# EAGLE design lime-lemon (EAGLE 7.4.0)
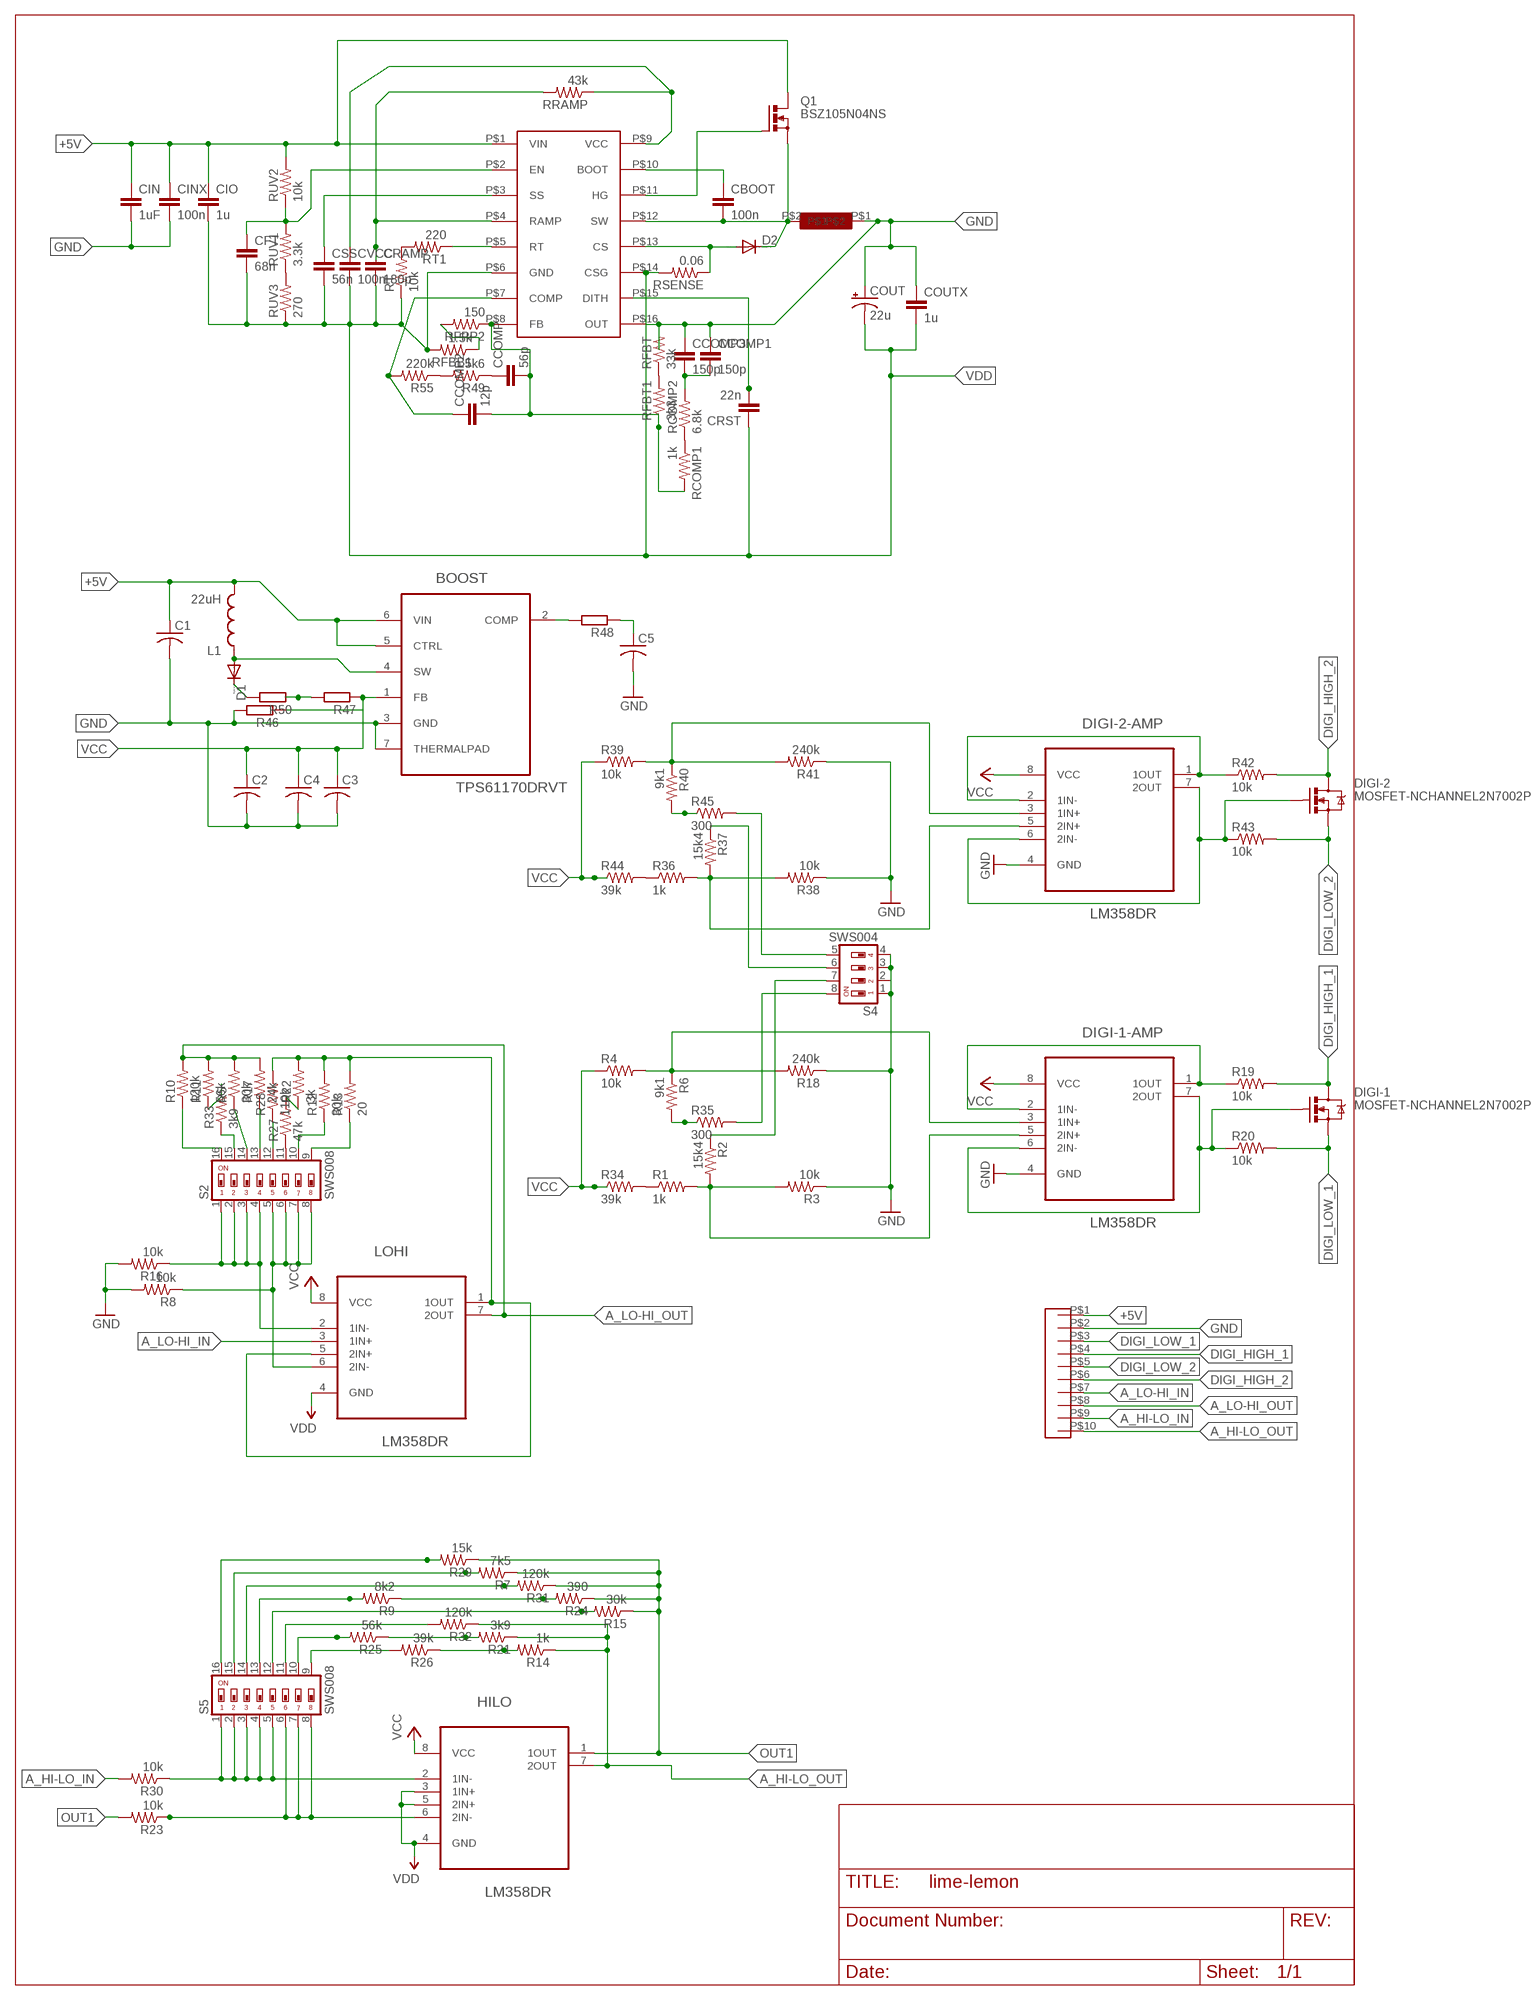
[diagram p0: schematic, sheet 1]

## Parts
BOOST  TPS61170DRVT  [SON65P210X210X80-7N]
C1  C-USC1206  [C1206]
C2  C-USC0805  [C0805]
C3  C-USC1206  [C1206]
C4  C-USC1206  [C1206]
C5  C-USC1206  [C1206]
CBOOT  100n  C-EUC0805  [C0805]
CCOMP  56p  C-EUC0805  [C0805]
CCOMP1  150p  C-EUC0805  [C0805]
CCOMP2  12p  C-EUC0805  [C0805]
CCOMP3  150p  C-EUC0805  [C0805]
CFT  68n  C-EUC0805  [C0805]
CIN  1uF  C-EUC0805  [C0805]
CINX  100n  C-EUC0805  [C0805]
CIO  1u  C-EUC0805  [C0805]
COUT  22u  CPOL-USE5-5  [E5-5]
COUTX  1u  C-EUC0805  [C0805]
CRAMP  180p  C-EUC0805  [C0805]
CRST  22n  C-EUC0805  [C0805]
CSS  56n  C-EUC0805  [C0805]
CVCC  100n  C-EUC0805  [C0805]
D1  DIODE-SOD123  [SOD123]
D2  DIODE-SOD123  [SOD123]
DIGI-1  MOSFET-NCHANNEL2N7002PW  [SOT323]
DIGI-1-AMP  LM358DR  [SOIC127P600X175-8N]
DIGI-2  MOSFET-NCHANNEL2N7002PW  [SOT323]
DIGI-2-AMP  LM358DR  [SOIC127P600X175-8N]
HILO  LM358DR  [SOIC127P600X175-8N]
L1  22uH  INDUCTORBOURNS_SRN6045  [SRN6045]
LOHI  LM358DR  [SOIC127P600X175-8N]
Q1  BSZ105N04NS  [PG-TDSON-8]
R1  1k  R-US_R0805  [R0805]
R2  15k4  R-US_R0805  [R0805]
R3  10k  R-US_R0805  [R0805]
R4  10k  R-US_R0805  [R0805]
R5  30k  R-US_R0805  [R0805]
R6  9k1  R-US_R0805  [R0805]
R7  7k5  R-US_R0805  [R0805]
R8  10k  R-US_R0805  [R0805]
R9  8k2  R-US_R0805  [R0805]
R10  120k  R-US_R0805  [R0805]
R11  56k  R-US_R0805  [R0805]
R12  30k  R-US_R0805  [R0805]
R13  20  R-US_R0805  [R0805]
R14  1k  R-US_R0805  [R0805]
R15  30k  R-US_R0805  [R0805]
R16  10k  R-US_R0805  [R0805]
R17  24k  R-US_R0805  [R0805]
R18  240k  R-US_R0805  [R0805]
R19  10k  R-US_R0805  [R0805]
R20  10k  R-US_R0805  [R0805]
R21  3k9  R-US_R0805  [R0805]
R22  3k  R-US_R0805  [R0805]
R23  10k  R-US_R0805  [R0805]
R24  390  R-US_R0805  [R0805]
R25  56k  R-US_R0805  [R0805]
R26  39k  R-US_R0805  [R0805]
R27  47k  R-US_R0805  [R0805]
R28  110k  R-US_R0805  [R0805]
R29  15k  R-US_R0805  [R0805]
R30  10k  R-US_R0805  [R0805]
R31  120k  R-US_R0805  [R0805]
R32  120k  R-US_R0805  [R0805]
R33  3k9  R-US_R0805  [R0805]
R34  39k  R-US_R0805  [R0805]
R35  300  R-US_R0805  [R0805]
R36  1k  R-US_R0805  [R0805]
R37  15k4  R-US_R0805  [R0805]
R38  10k  R-US_R0805  [R0805]
R39  10k  R-US_R0805  [R0805]
R40  9k1  R-US_R0805  [R0805]
R41  240k  R-US_R0805  [R0805]
R42  10k  R-US_R0805  [R0805]
R43  10k  R-US_R0805  [R0805]
R44  39k  R-US_R0805  [R0805]
R45  300  R-US_R0805  [R0805]
R46  R-EU_R0805  [R0805]
R47  R-EU_R0805  [R0805]
R48  R-EU_R0805  [R0805]
R49  5k6  R-US_R0805  [R0805]
R50  R-EU_R0805  [R0805]
R55  220k  R-US_R0805  [R0805]
RCOMP1  1k  R-US_R0805  [R0805]
RCOMP2  6.8k  R-US_R0805  [R0805]
RFBB1  1.5k  R-US_R0805  [R0805]
RFBT  33k  R-US_R0805  [R0805]
RFBT1  3k3  R-US_R0805  [R0805]
RFPP2  150  R-US_R0805  [R0805]
RRAMP  43k  R-US_R0805  [R0805]
RSENSE  0.06  R-US_R0805  [R0805]
RT  10k  R-US_R0805  [R0805]
RT1  220  R-US_R0805  [R0805]
RUV1  3.3k  R-US_R0805  [R0805]
RUV2  10k  R-US_R0805  [R0805]
RUV3  270  R-US_R0805  [R0805]
S2  SWS008  [SMS-008]
S4  SWS004  [SMS-004]
S5  SWS008  [SMS-008]
U$1  5.08PITCHTERMINAL  [10KPL508]
U$2  LM5088  [LM5088]
U$3  KLICK_INDUCTOR01  [KLICK_INDUCTOR01]

## Nets
+5V: BOOST.5(CTRL) BOOST.6(VIN) C1.1 CIN.1 CINX.1 CIO.1 L1.2 Q1.5(D) Q1.6(D) Q1.7(D) Q1.8(D) Q1.TH(D) RUV2.2 U$1.P$1 U$2.P$1(VIN)
A_HI-LO_IN: R30.2 U$1.P$9
A_HI-LO_OUT: HILO.7(2OUT) R14.1 R21.1 R32.1 U$1.P$10
A_LO-HI_IN: LOHI.3(1IN+) U$1.P$7
A_LO-HI_OUT: LOHI.7(2OUT) R5.2 R10.2 R11.2 R17.2 U$1.P$8
DI-1: DIGI-1-AMP.1(1OUT) DIGI-1-AMP.2(1IN-) R19.1
DIGI_HIGH_1: DIGI-1.3(D) R19.2 U$1.P$4
DIGI_HIGH_2: DIGI-2.3(D) R42.2 U$1.P$6
DIGI_LOW_1: DIGI-1.2(S) R20.2 U$1.P$3
DIGI_LOW_2: DIGI-2.2(S) R43.2 U$1.P$5
GND: BOOST.3(GND) BOOST.7(THERMALPAD) C1.2 C2.2 C3.2 C4.2 C5.2 CCOMP1.1 CCOMP3.1 CIN.2 CINX.2 COUT.+ COUTX.1 DIGI-1-AMP.4(GND) DIGI-2-AMP.4(GND) R3.1 R8.2 R16.2 R18.1 R38.1 R41.1 R46.2 RFBT.2 S4.1 S4.2 S4.3 S4.4 U$1.P$2 U$2.P$16(OUT) U$3.P$1
N$2: DIGI-1-AMP.3(1IN+) R4.2 R6.1 R18.2
N$4: R2.1 S4.7
N$5: R6.2 R35.1
N$6: DIGI-1-AMP.5(2IN+) R1.2 R2.2 R3.2
N$8: DIGI-1-AMP.6(2IN-) DIGI-1-AMP.7(2OUT) DIGI-1.1(G) R20.1
N$9: DIGI-2-AMP.5(2IN+) R36.2 R37.2 R38.2
N$10: HILO.2(1IN-) R30.1 S5.1 S5.2 S5.3 S5.4 S5.5
N$11: DIGI-2-AMP.3(1IN+) R39.2 R40.1 R41.2
N$13: R10.1 S2.16
N$14: R33.1 S2.15
N$15: R1.1 R34.2
N$16: R5.1 S2.14
N$17: R17.1 S2.13
N$18: R28.1 S2.12
N$19: R27.1 S2.11
N$20: R12.1 S2.10
N$21: R13.1 S2.9
N$22: R29.2 S5.16
N$23: LOHI.1(1OUT) LOHI.5(2IN+) R12.2 R13.2 R22.2 R28.2
N$24: R7.2 S5.15
N$26: R31.2 S5.14
N$27: R9.2 S5.13
N$28: R15.2 S5.12
N$29: R32.2 S5.11
N$30: HILO.6(2IN-) R23.1 S5.6 S5.7 S5.8
N$31: R25.2 S5.10
N$32: R26.2 S5.9
N$34: R14.2 R26.1
N$36: R21.2 R25.1
N$37: R9.1 R24.2
N$38: R22.1 R27.2
N$41: R11.1 R33.2
N$42: R35.2 S4.8
N$43: CFT.1 RUV1.2 RUV2.1 U$2.P$2(EN)
N$44: BOOST.4(SW) D1.A L1.1
N$45: CSS.1 U$2.P$3(SS)
N$46: LOHI.2(1IN-) R16.1 S2.1 S2.2 S2.3 S2.4
N$47: R47.2 R50.1
N$48: CVCC.1 RRAMP.1 U$2.P$9(VCC)
N$49: BOOST.2(COMP) R48.2
N$50: LOHI.6(2IN-) R8.1 S2.5 S2.6 S2.7 S2.8
N$51: C5.1 R48.1
N$52: D2.A RSENSE.1 U$2.P$13(CS)
N$53: CRAMP.1 RRAMP.2 U$2.P$4(RAMP)
N$54: RT1.2 RT.2
N$55: RUV1.1 RUV3.2
N$56: CCOMP.1 R49.1
N$57: CCOMP2.2 CCOMP.2 RCOMP1.2 RFBT1.1 RFPP2.1 U$2.P$8(FB)
N$58: CCOMP2.1 R55.2 U$2.P$7(COMP)
N$59: CBOOT.1 U$2.P$10(BOOT)
N$60: CRST.2 U$2.P$15(DITH)
N$61: CBOOT.2 D2.C Q1.1(S) Q1.2(S) Q1.3(S) U$2.P$12(SW) U$3.P$2
N$62: RFBB1.1 RFPP2.2
N$63: DIGI-2-AMP.1(1OUT) DIGI-2-AMP.2(1IN-) R42.1
N$64: DIGI-2-AMP.6(2IN-) DIGI-2-AMP.7(2OUT) DIGI-2.1(G) R43.1
N$65: Q1.4(G) U$2.P$11(HG)
N$66: R49.2 R55.1
N$67: R37.1 S4.6
N$68: R36.1 R44.2
N$69: R40.2 R45.1
N$70: R45.2 S4.5
N$71: CCOMP1.2 CCOMP3.2 RCOMP2.2
N$72: RT1.1 U$2.P$5(RT)
N$73: RCOMP1.1 RCOMP2.1
N$74: RFBT1.2 RFBT.1
N$75: D1.C R50.2
OUT1: HILO.1(1OUT) R7.1 R15.1 R23.2 R24.1 R29.1 R31.1
VCC: BOOST.1(FB) C2.1 C3.1 C4.1 DIGI-1-AMP.8(VCC) DIGI-2-AMP.8(VCC) HILO.8(VCC) LOHI.8(VCC) R4.1 R34.1 R39.1 R44.1 R46.1 R47.1
VDD: CFT.2 CIO.2 COUT.- COUTX.2 CRAMP.2 CRST.1 CSS.2 CVCC.2 HILO.3(1IN+) HILO.4(GND) HILO.5(2IN+) LOHI.4(GND) RFBB1.2 RSENSE.2 RT.1 RUV3.1 U$2.P$6(GND) U$2.P$14(CSG)

## Library data of the parts
BOOST = Texas Instruments_By_element14_Batch_1:TPS61170DRVT: 1.2A High Voltage Boost Converter in 2x2mm2 QFN Package; MPN: TPS61170DRVT; OC_FARNELL: 1703404; OC_NEWARK: 65M6342; PACKAGE: SON-6; SUPPLIER: Texas Instruments
C1-C5 = rcl:C-US: CAPACITOR, American symbol
CBOOT CCOMP CCOMP1-CCOMP3 CFT CIN CINX CIO COUTX CRAMP CRST CSS CVCC = rcl:C-EU: CAPACITOR, European symbol
COUT = rcl:CPOL-US: POLARIZED CAPACITOR, American symbol
D1 D2 = diode:DIODE-: DIODE
DIGI-1 DIGI-2 = SparkFun-DiscreteSemi:MOSFET-NCHANNEL: Common NMOSFET Parts MFG P/N Store ID Prod ID FDD8780 TRANS-09984 SI7820DN TRANS-11055 FDS6630A IC-08089 2N7002PW TRANS-11151 FQP30N06L COM-10213 TRANS-10060 BSS123LT1G TRANS-08345 BSS138 TRANS-00830 BS170 2N7000; PROD_ID: TRANS-11151
DIGI-1-AMP DIGI-2-AMP HILO LOHI = Texas Instruments_By_element14_Batch_1:LM358DR: OPERATIONAL AMPLIFIERS; MPN: LM358DR; OC_FARNELL: 1831865; OC_NEWARK: 34K7599; PACKAGE: SOIC-8; SUPPLIER: Texas Instruments
L1 = SparkFun-Passives:INDUCTOR: Inductors Basic Inductor/Choke - 0603 and 1206. Footprints are not proven and vary greatly between part numbers. INDUCTOR POWER 3.3UH 4.0A SMD 0.197" L x 0.197" W x 0.177" H (5.00mm x 5.00mm x 4.50mm); PROD_ID: NDUC-11627; VALUE: 33uH
Q1 = transistor-power:BSZ105N04NS: OptiMOS (TM)3 Power-Transistor N-Channel, Normal level Source : Data sheet <http://www.infineon.com/dgdl/BSZ105N04NSG_rev1.1.pdf?folderId=db3a3043156fd5730115c7d50620107c&fileId=db3a30431689f4420116c485c67f084e>
R1-R45 R49 R55 RCOMP1 RCOMP2 RFBB1 RFBT RFBT1 RFPP2 RRAMP RSENSE RT RT1 RUV1-RUV3 = rcl:R-US_: RESISTOR, American symbol
R46-R48 R50 = rcl:R-EU_: RESISTOR, European symbol
S2 S5 = smd-special:SWS008: SMD Dip Switch 8 pol.
S4 = smd-special:SWS004: SMD Dip Switch 4 pol.
U$1 = ruuviliitin:5.08PITCHTERMINAL
U$2 = Klick_custom_lm5088:LM5088
U$3 = Klick_inductor01:KLICK_INDUCTOR01

## Board
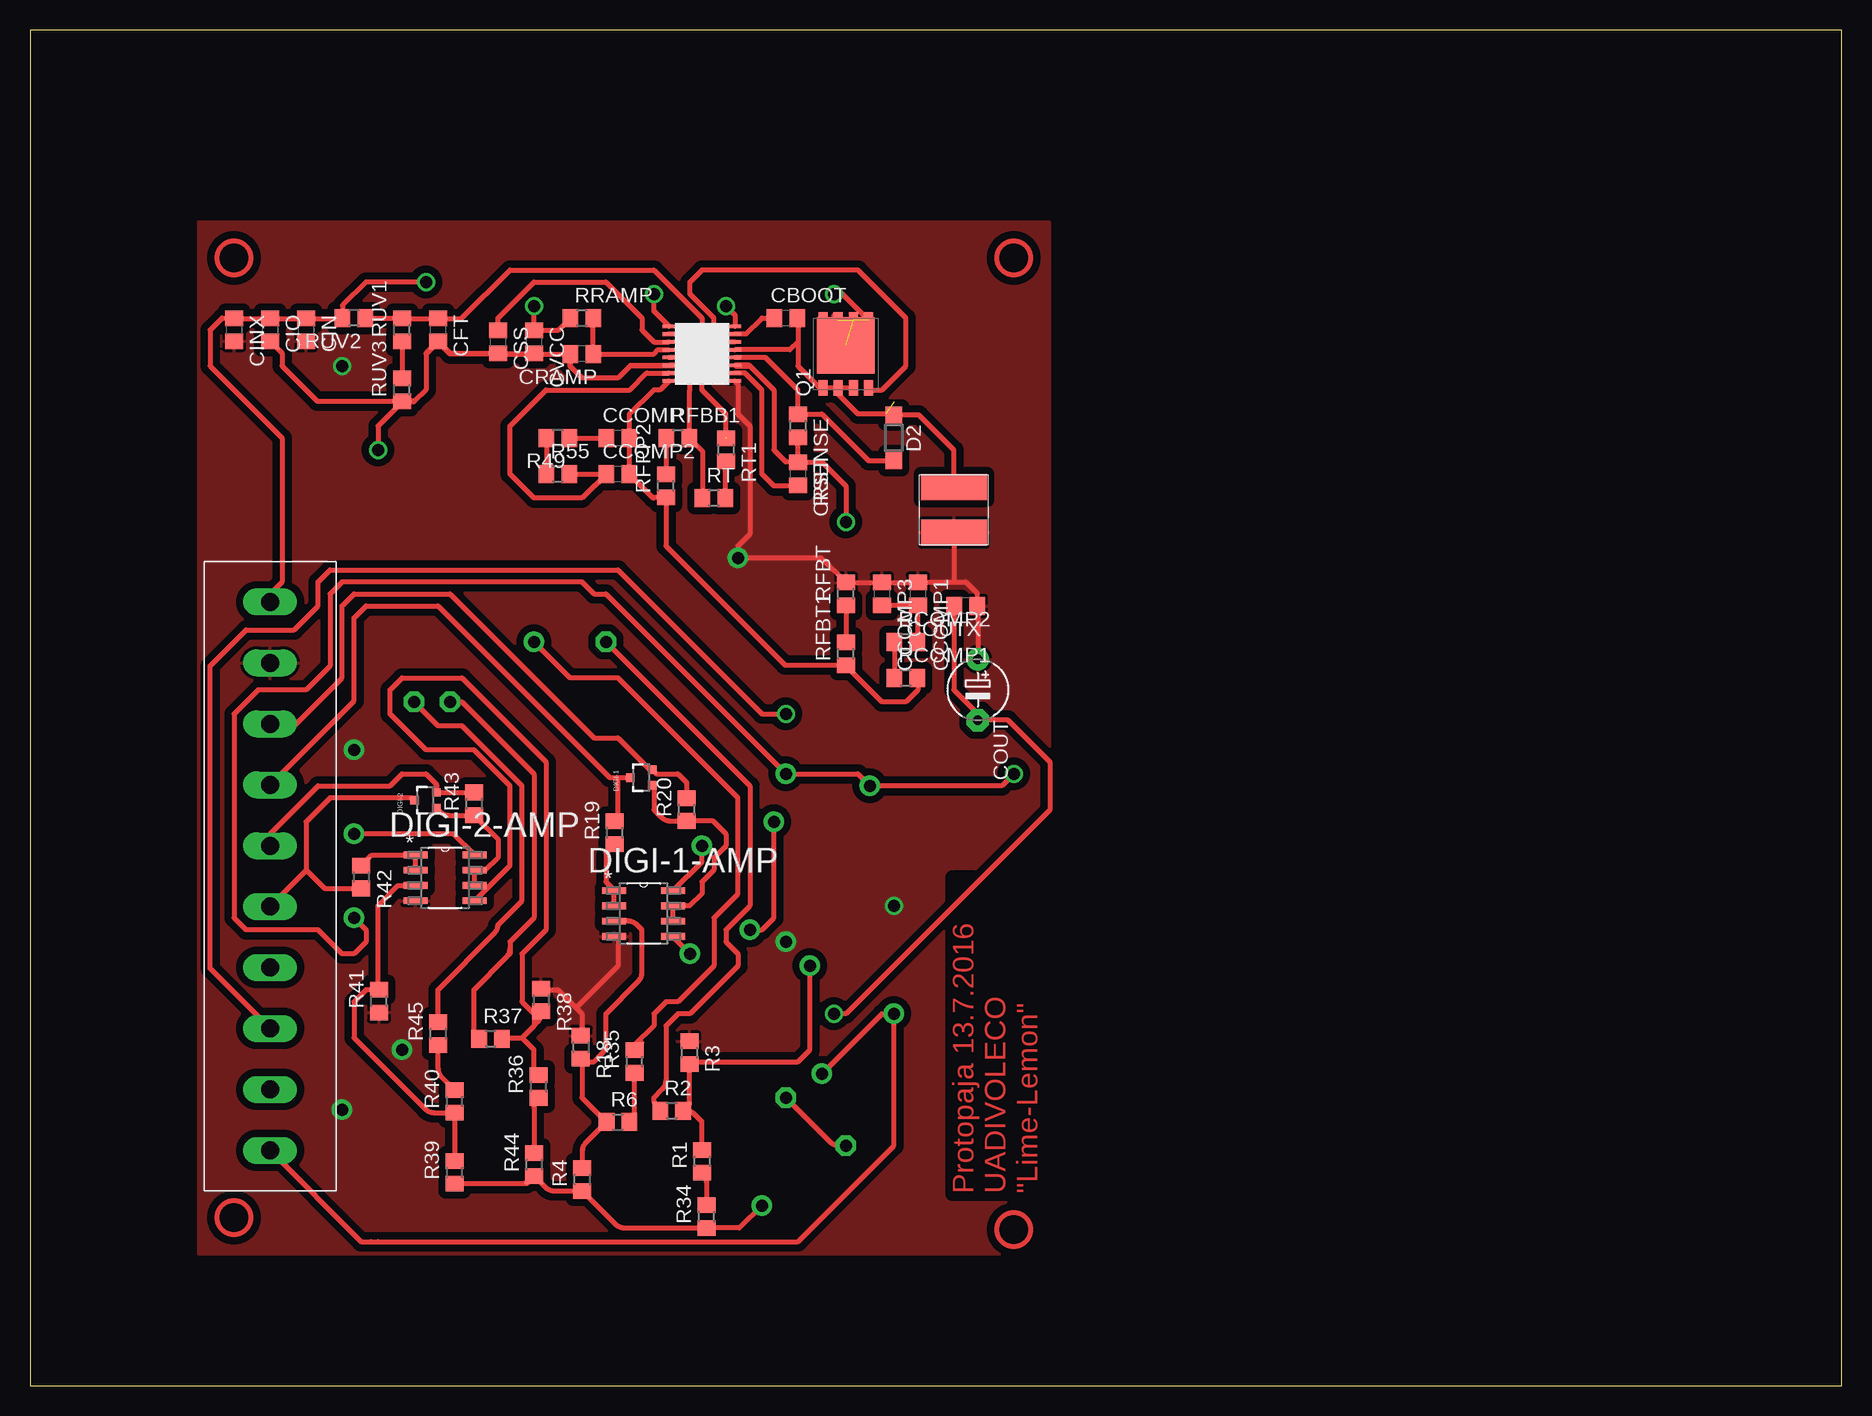
[diagram p1: board, top side]
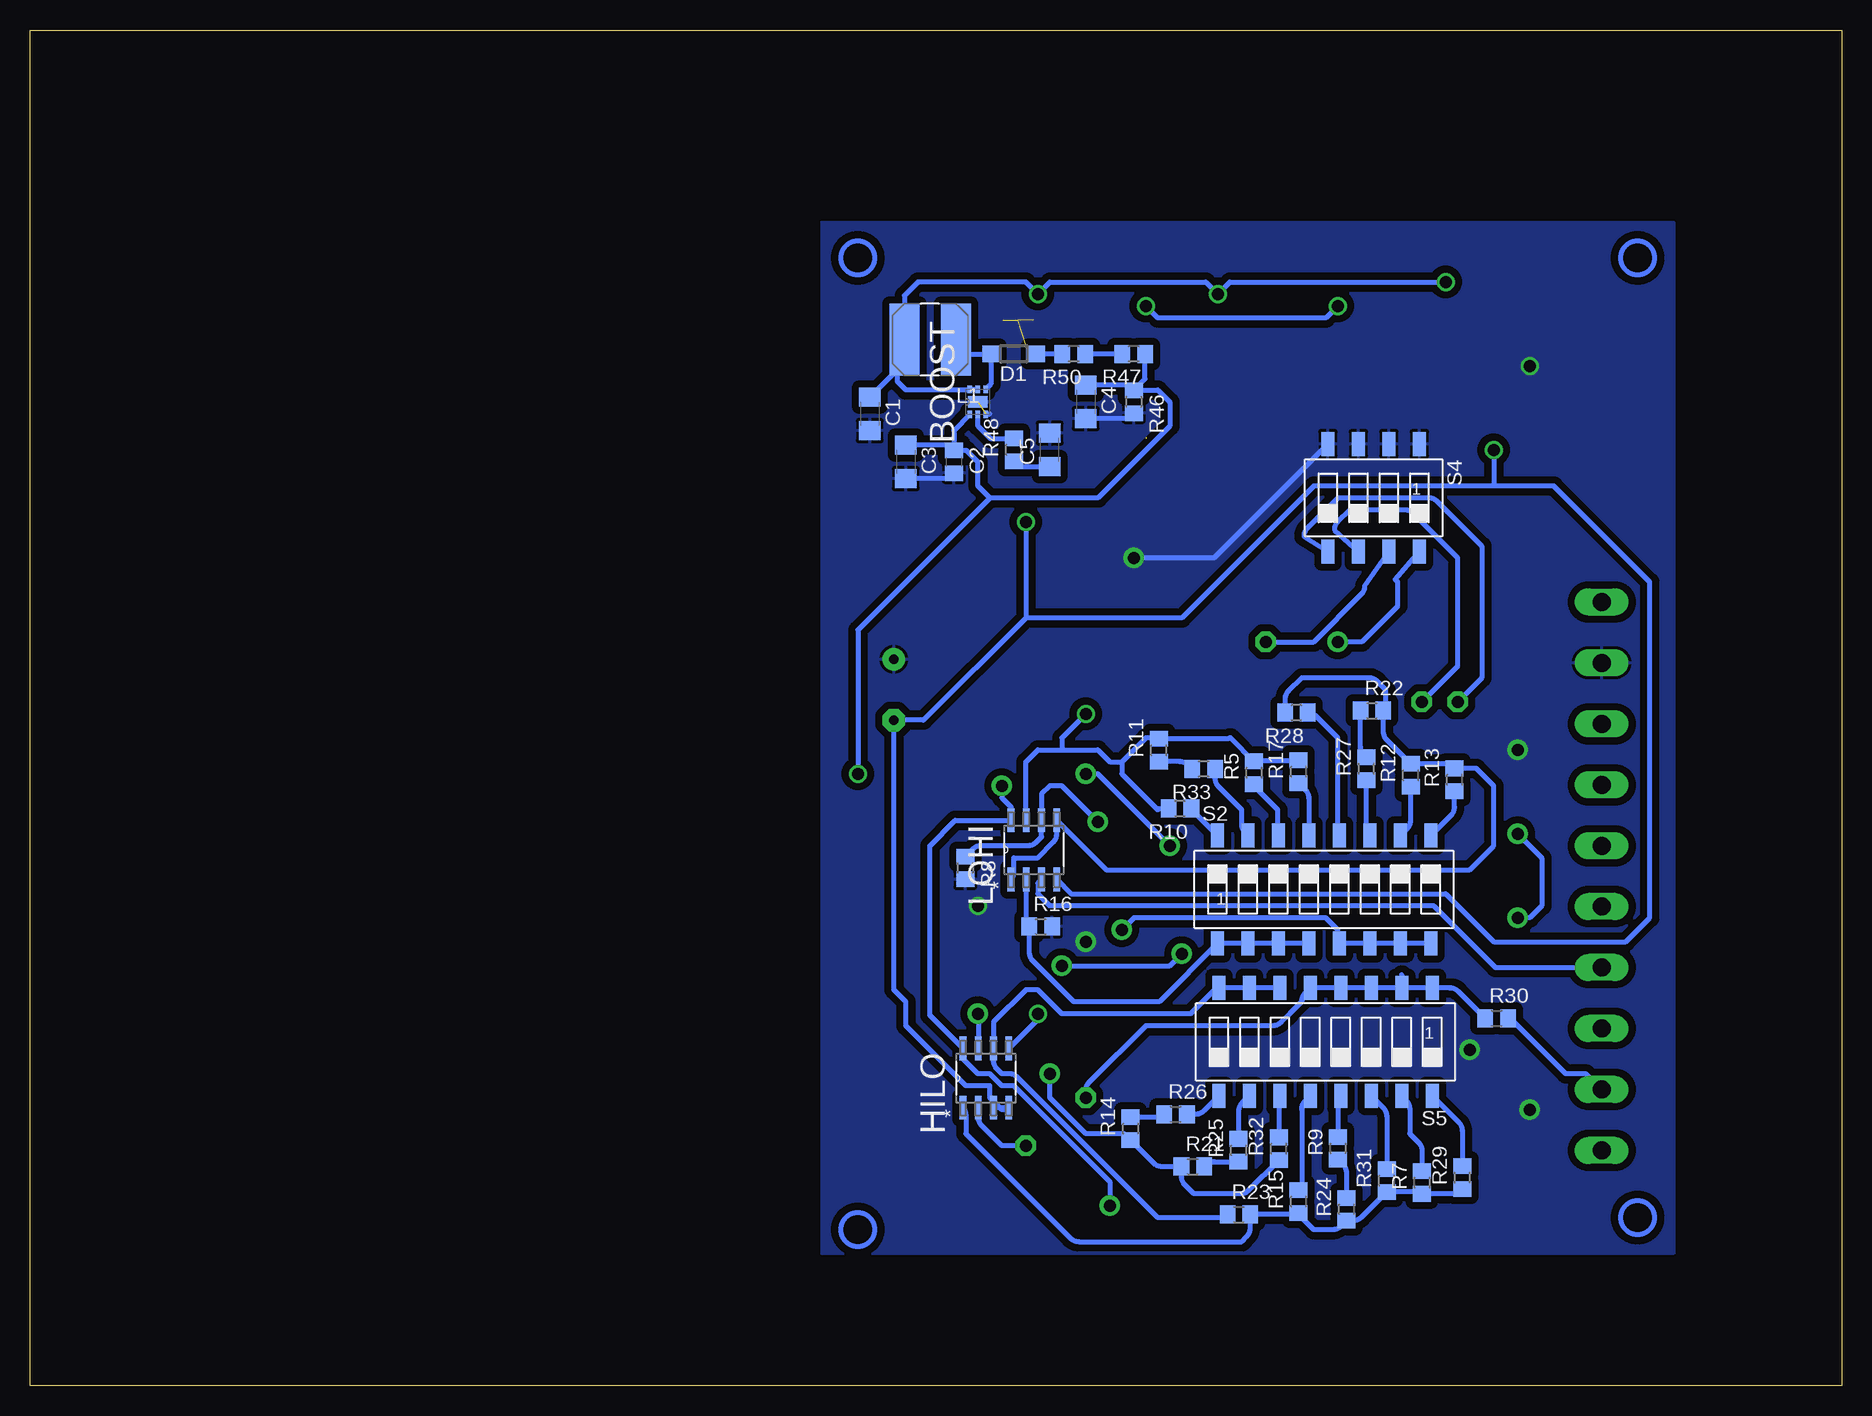
[diagram p2: board, bottom side, seen from below]

Size 151 x 113 mm. Coordinates in mm from the lower left corner, seen from the top.
Outline: 0,0 151,0 151,113 0,113 0,0
Copper layers (1*16): Top 0.035mm / dielectric 1.5mm / Bottom 0.035mm
Design rules "default": minimum track width 10mil, minimum drill 24mil, track to track 8mil, track to pad 8mil, pad to pad 8mil, via to via 8mil, smd to smd 8mil, copper to edge 40mil, drill to drill 8mil, minimum pad ring 10mil, minimum via ring 8mil, stop-mask expansion 4mil, vias tented up to drill 0mil, thermal gap 10mil

### Footprints (pad centres in the part's own frame; a part is rotated, then mirrored left to right if it is on the bottom)
SON65P210X210X80-7N = smd 0.61 x 0.356: 1 -1.041,0.66; 2 -1.041,0; 3 -1.041,-0.66; 4 1.041,-0.66; 5 1.041,0; 6 1.041,0.66 | smd 0.991 x 1.6: 7 0,0
C1206 = smd 1.6 x 1.8: 1 -1.4,0; 2 1.4,0
C0805 = smd 1.3 x 1.5: 1 -0.95,0; 2 0.95,0
E5-5 = drill 0.813 pad 1.905: + -2.54,0 | drill 0.813 pad 1.905 octagon: - 2.54,0
SOD123 = smd 1.4 x 1.4: A 1.9,0; C -1.9,0
SOT323 = smd 0.7 x 0.7: 1 -0.65,-0.925; 2 0.65,-0.925; 3 0,0.925
SOIC127P600X175-8N = smd 1.981 x 0.559: 1 -2.464,1.905; 2 -2.464,0.635; 3 -2.464,-0.635; 4 -2.464,-1.905; 5 2.464,-1.905; 6 2.464,-0.635; 7 2.464,0.635; 8 2.464,1.905
SRN6045 = smd 2.5 x 6: 1 -2.175,-0.175; 2 2.125,-0.175
PG-TDSON-8 = smd 1.3 x 0.75: 1 -2.825,1.905; 2 -2.825,0.635; 3 -2.825,-0.635; 4 -2.825,-1.905; 5 2.825,-1.905; 6 2.825,-0.635; 7 2.825,0.635; 8 2.825,1.905 | smd 4.7 x 4.8: TH 0.725,0
R0805 = smd 1.3 x 1.5: 1 -0.95,0; 2 0.95,0
SMS-008 = smd 1.092 x 2.007: 1 -8.89,-4.496; 2 -6.35,-4.496; 3 -3.81,-4.496; 4 -1.27,-4.496; 5 1.27,-4.496; 6 3.81,-4.496; 7 6.35,-4.496; 8 8.89,-4.496; 9 8.89,4.496; 10 6.35,4.496; 11 3.81,4.496; 12 1.27,4.496; 13 -1.27,4.496; 14 -3.81,4.496; 15 -6.35,4.496; 16 -8.89,4.496
SMS-004 = smd 1.092 x 2.007: 1 -3.81,-4.496; 2 -1.27,-4.496; 3 1.27,-4.496; 4 3.81,-4.496; 5 3.81,4.496; 6 1.27,4.496; 7 -1.27,4.496; 8 -3.81,4.496
10KPL508 = drill 1.5 long: P$1 -20.32,0; P$2 -15.24,0; P$3 -10.16,0; P$4 -5.08,0; P$5 0,0; P$6 5.08,0; P$7 10.16,0; P$8 15.24,0; P$9 20.32,0; P$10 25.4,0
LM5088 = smd 1.05 x 0.3: P$1 -2.75,2.3; P$2 -2.75,1.65; P$3 -2.75,1; P$4 -2.75,0.35; P$5 -2.75,-0.3; P$6 -2.75,-0.95; P$7 -2.75,-1.6; P$8 -2.75,-2.25; P$9 2.75,2.3; P$10 2.75,1.65; P$11 2.75,1; P$12 2.75,0.35; P$13 2.75,-0.3; P$14 2.75,-0.95; P$15 2.75,-1.6; P$16 2.75,-2.25
KLICK_INDUCTOR01 = smd 2.15 x 5.5: P$1 -1.9,0; P$2 1.9,0

### Placement (x,y rotation side)
BOOST  72,82 90 bottom
C1  81,81 270 bottom
C2  74,77 270 bottom
C3  78,77 270 bottom
C4  63,82 270 bottom
C5  66,78 90 bottom
CBOOT  63,89 0 top
CCOMP  49,79 0 top
CCOMP1  74,66 270 top
CCOMP2  49,76 0 top
CCOMP3  71,66 270 top
CFT  34,88 270 top
CIN  23,88 270 top
CINX  17,88 270 top
CIO  20,88 270 top
COUT  79,58 270 top
COUTX  78,65 180 top
CRAMP  46,86 180 top
CRST  64,76 270 top
CSS  39,87 270 top
CVCC  42,87 270 top
D1  69,86 180 bottom
D2  72,79 270 top
DIGI-1  50.96,50.68 90 top
DIGI-1-AMP  51.15,39.35 0 top
DIGI-2  32.96,48.79 90 top
DIGI-2-AMP  34.6,42.32 0 top
HILO  71.32,25.63 90 bottom
L1  76,87 180 bottom
LOHI  67.32,44.66 90 bottom
Q1  68,86 90 top
R1  56.04,18.69 90 top
R2  53.49,22.91 0 top
R3  54.96,27.75 270 top
R4  46.04,17.17 90 top
R5  48.96,51.09 90 bottom
R6  49.01,21.96 0 top
R7  34.96,16.93 90 bottom
R8  73.04,43.15 270 bottom
R9  41.96,19.77 90 bottom
R10  55.14,48.09 180 bottom
R11  56.91,52.96 90 bottom
R12  35.91,50.88 90 bottom
R13  32.26,50.49 90 bottom
R14  59.26,21.41 90 bottom
R15  45.26,15.33 90 bottom
R16  66.75,38.26 0 bottom
R17  45.26,51.17 90 bottom
R18  45.91,28.21 270 top
R19  48.74,46.09 90 top
R20  54.74,48.01 90 top
R21  54.07,18.26 0 bottom
R22  39.15,56.26 0 bottom
R23  50.23,14.26 0 bottom
R24  41.26,14.69 90 bottom
R25  50.26,19.61 90 bottom
R26  55.51,22.61 0 bottom
R27  39.61,51.41 90 bottom
R28  45.44,56.09 180 bottom
R29  31.61,17.33 90 bottom
R30  28.75,30.61 0 bottom
R31  37.91,17.09 90 bottom
R32  46.91,19.74 90 bottom
R33  53.17,51.39 180 bottom
R34  56.39,14.09 90 top
R35  50.39,27.01 90 top
R36  42.39,24.93 90 top
R37  38.39,28.91 0 top
R38  42.61,32.15 270 top
R39  35.39,17.77 90 top
R40  35.39,23.69 90 top
R41  29.09,32.04 90 top
R42  27.61,42.39 270 top
R43  37.04,48.49 90 top
R44  42.04,18.41 90 top
R45  34.04,29.33 90 top
R46  59,82 270 bottom
R47  59,86 180 bottom
R48  69,78 90 bottom
R49  44,79 180 top
R50  64,86 180 bottom
R55  44,76 0 top
RCOMP1  73,59 0 top
RCOMP2  73,62 0 top
RFBB1  54,79 0 top
RFBT  68,66 90 top
RFBT1  68,61 90 top
RFPP2  53,75 90 top
RRAMP  46,89 0 top
RSENSE  64,80 270 top
RT  57,74 0 top
RT1  58,78 270 top
RUV1  31,88 90 top
RUV2  27,89 180 top
RUV3  31,83 90 top
S2  43.13,41.35 0 bottom
S4  39,74 180 bottom
S5  43.01,28.65 180 bottom
U$1  20,45 270 top
U$2  56,86 0 top
U$3  77,73 90 top

### Tracks (layer width: path | path; a pad name or v marks a point on that pad's centre or on a via)
+5V  (via drill 1 pad 1.42)  (3 unrouted)
  Top 0.406: CINX.1 CIO.1 CIN.1 | CINX.1 26.05,88.95 RUV2.2 26.05,90.05 28,92 v33,92 | CINX.1 16.95,89 16,89 15,88 15,85 21,79 21,67 20,66 U$1.P$1 | Q1.8 Q1.7 67,89.19 | U$2.P$1 52,89.55 v52,91 | Q1.5 67.73,91 v67,91
  Bottom 0.406: v33,92 51,92 v52,91 53,92 66,92 v67,91 68,92 77,92 78.12,90.88 L1.2 78.12,85.28 78.7,84.7 | BOOST.5 BOOST.6 72.7,83 78,83 78.7,83.7 78.7,84.7 | C1.1 78.7,84.7
A_HI-LO_IN
  Bottom 0.406: U$1.P$9 21.32,26 23,26 27.61,30.61 R30.2
A_HI-LO_OUT  (via drill 1 pad 1.68)
  Top 0.406: v66,26 71,31 v72,31 72,20 64,12 29,12 28.42,12 27.6,12 U$1.P$10
  Bottom 0.406: R32.1 49.49,16.21 arc45 50,16 54,16 54.73,16.73 arc45 55.02,17.43 R21.1 56.65,18.26 arc45 57.35,18.55 R14.1 59.8,21 63,21 66,24 v66,26 | v72,31 71.95,30.95 HILO.7
A_LO-HI_IN
  Bottom 0.406: LOHI.3 67,41.88 67,41 66,40 34,40 28.84,34.84 U$1.P$7
A_LO-HI_OUT  (via drill 1 pad 1.42)
  Top 0.406: U$1.P$8 15,34.76 15,60 18,63 22,63 24,65 24,67 25,68 49,68 61,56 v63,56
  Bottom 0.406: R17.2 48.77,52.12 arc-45 R5.2 50.86,53.94 arc-45 51,54 arc45 51.22,53.91 R11.2 57,54 58,54 60,52 | 60,52 60,51 57,48 56.91,48.09 R10.2 | LOHI.7 68,47.17 68,52 67,53 65,53 | 65,53 62,53 61,52 60,52 | v63,56 65,54 65,53
DI-1
  Top 0.406: R19.1 48,44.4 48,42 48.69,41.31 DIGI-1-AMP.1 DIGI-1-AMP.2
DIGI_HIGH_1
  Top 0.406: 49,50.68 48.32,50.68 34,65 28,65 27,64 27,57.08 U$1.P$4 | 49,50.68 DIGI-1.3 | R19.2 49,47.3 49,50.68
DIGI_HIGH_2
  Top 0.406: DIGI-2.3 31.82,49 25,49 23,47 23,43 | 23,43 24.56,41.44 R42.2 | U$1.P$6 23,42.92 23,43
DIGI_LOW_1
  Top 0.406: U$1.P$3 20.16,55 22,55 26,59 26,65 27,66 35,66 47,54 49,54 51.67,51.33 DIGI-1.2 52.22,51 54,51 54.74,50.26 R20.2
DIGI_LOW_2
  Top 0.406: R43.2 DIGI-2.2 33.89,50.12 33,51 31,51 30,50 24,50 20,46 U$1.P$5
GND  (via drill 1 pad 1.42, 1 pad 1.68)  (1 unrouted)
  Top 0.406: R38.1 42.71,33 44,33 45.5,31.5 | 45.5,31.5 46,31 46,29 45.91,29.09 R18.1 | DIGI-1-AMP.4 49,37.13 49,35 45.5,31.5 | U$2.P$16 59,83.5 59,81 60,80 60,71 59,70 v59,69 65.95,69 RFBT.2 CCOMP3.1 CCOMP1.1 74.05,67 77,67 | 77,67 78,67 78.95,66.05 COUTX.1 79,64.95 COUT.+ | U$3.P$1 77,67
  Bottom 0.406: S4.4 52.31,69 v59,69 | C2.2 74.45,75.6 C3.2 | R46.2 59.45,80.6 C4.2 | BOOST.3 71.3,81 71,81
  other vias: 26,23 31,28 63,37 27,53 72,40 26,85
  pour Top (isolate 0.61, rank 6): 14,97 14,11 85,11 85,97
  pour Bottom (isolate 0.61): 14,97 14,11 85,11 85,97
N$2
  Top 0.406: R4.2 46.04,19.53 arc-45 46.33,20.23 R6.1 arc-45 48.03,21.97 46,24 46,27.04 arc45 R18.2 arc45 46.54,27 47,27 47.71,27.71 arc45 48,28.41 48,31 50.71,33.71 arc45 51,34.41 51,38 50.58,38.42 arc45 49.87,38.72 DIGI-1-AMP.3
N$4  (via drill 1 pad 1.68)
  Top 0.406: R2.1 52.29,23.16 arc-45 52,23.86 52,24 52.71,24.71 arc45 53,25.41 53,30 54,31 55,31 59,35 59,36 58,37 58,38 60,40 60,50 v48,62
  Bottom 0.406: v48,62 44,62 40.02,65.98 arc-45 39.73,66.68 S4.7
N$5
  Top 0.406: R6.2 50.1,22.1 arc45 50.39,22.8 R35.1
N$6  (via drill 1 pad 1.68)
  Top 0.406: R1.2 arc-45 56,19.74 56,22 55.38,22.62 arc45 54.68,22.91 | 54.68,22.91 R2.2 | 54.68,22.91 arc45 54.96,23.6 R3.2 55.16,27 64,27 65,28 v65,35 | v55,36 53.61,37.39 DIGI-1-AMP.5
  Bottom 0.406: v65,35 56,35 v55,36
N$8
  Top 0.406: DIGI-1.1 arc-45 52,49.75 52,48 52.65,47.35 arc45 53.35,47.06 R20.1 56.94,47.06 58,46 58,45 57,44 57,43 56,42 56,41 54.98,39.98 DIGI-1-AMP.7 | 54.57,39.98 DIGI-1-AMP.7 | DIGI-1-AMP.6 DIGI-1-AMP.7
N$9
  Top 0.406: R37.2 arc-45 39.56,29 41,29 | 41,29 42,30 | 42,30 42.32,30.32 arc45 42.61,31.02 R38.2 | R36.2 42.29,25.98 arc-45 42,26.68 42,28 41,29 | DIGI-2-AMP.5 40,43.35 40,50 37,53 33,53 30,56 30,58 31,59 36,59 43,52 43,38 41,36 41,32 42,31 42,30
N$10  (via drill 1 pad 1.68)
  Top 0.406: v63,24 66.71,20.29 arc45 67.41,20 v68,20
  Bottom 0.406: S5.2 S5.1 32.65,33.15 arc45 31.94,32.85 R30.1 | S5.2 S5.3 S5.4 S5.5 44.71,32.72 arc-45 45,32.01 45.99,31.02 arc-45 46,31 46.71,30.29 arc45 47.41,30 58,30 62.71,25.29 arc-45 63,24.59 v63,24 | 36.66,34.24 S5.2 | v68,20 70,20 71.66,21.66 arc45 71.95,22.37 HILO.2
N$11
  Top 0.406: 35.71,19.04 R39.2 R40.1 | 29.07,33 arc-45 R41.2 arc45 29.07,33 | 29.07,33 28,33 27,32 27,29 32.97,23.03 arc45 33.67,22.74 R40.1 | R40.1 35.22,22.91 arc45 35,23 | 29.07,33 arc-45 29,33.16 29,40 30.68,41.69 DIGI-2-AMP.3
N$13
  Bottom 0.406: S2.16 54.14,47.96 arc45 R10.1
N$14
  Bottom 0.406: S2.15 49.71,46.07 arc45 50,46.78 50,48 51.93,49.93 arc45 52.22,50.63 R33.1
N$15
  Top 0.406: R1.1 56.1,17.68 arc-45 56.39,16.98 R34.2
N$16
  Bottom 0.406: S2.14 arc45 47,45.99 47,48 48.83,49.83 arc45 R5.1
N$17
  Bottom 0.406: R17.1 44.69,49.65 arc45 44.4,48.95 S2.13
N$18
  Bottom 0.406: S2.12 arc45 42,46.18 42,54 43.81,55.81 arc-45 R28.1
N$19
  Bottom 0.406: S2.11 arc45 39.61,46.55 R27.1
N$20
  Bottom 0.406: S2.10 36.2,46.42 arc-45 35.91,47.13 R12.1
N$21
  Bottom 0.406: S2.9 32.55,47.53 arc-45 32.26,48.24 R13.1
N$22
  Bottom 0.406: S5.16 31.9,21.94 arc45 31.61,21.23 R29.2
N$23
  Bottom 0.406: R28.2 46.39,57.2 arc45 46.1,57.9 45,59 39.41,59 arc45 38.71,58.71 38,58 38,56.74 arc45 R22.2 38.2,54.53 arc-45 37.91,53.83 R12.2 33.06,51.83 arc45 32.36,51.54 R13.2 30.44,51.44 29,50 29,45 31,43 61.29,43 LOHI.5 65.41,46 arc45 65.71,45.29 67,44 69,44 69,42.74 arc45 LOHI.1
N$24
  Bottom 0.406: S5.15 36.29,23.79 arc45 36,23.08 36,21 35.25,20.25 arc45 34.96,19.55 R7.2
N$26
  Bottom 0.406: S5.14 38.2,23.16 arc45 37.91,22.45 R31.2
N$27
  Bottom 0.406: S5.13 arc-45 41.96,23.62 R9.2
N$28
  Bottom 0.406: S5.12 44.71,23.73 arc-45 45,23.02 45,16 45.25,16.25 arc45 R15.2
N$29
  Bottom 0.406: S5.11 arc-45 46.91,23.94 R32.2
N$30
  Bottom 0.406: S5.6 S5.7 S5.8 arc45 52.25,33 54.25,31 65,31 67,33 68,33 70.69,30.32 HILO.6 | 70.69,28.9 HILO.6 | R23.1 arc45 51.81,14 57,14 68.71,25.71 arc-45 69.41,26 70,26 70.39,26.39 arc45 70.69,27.1 HILO.6
N$31
  Bottom 0.406: S5.10 49.97,23.55 arc-45 50.26,22.84 R25.2
N$32
  Bottom 0.406: S5.9 53.15,22.9 arc45 53.86,22.61 R26.2
N$34
  Bottom 0.406: R26.1 arc-45 56.53,22.64 arc45 57.21,22.36 R14.2
N$36
  Bottom 0.406: R21.2 53.01,18.37 arc45 52.31,18.66 R25.1
N$37
  Bottom 0.406: R9.1 41.55,18.41 arc45 41.26,17.71 R24.2
N$38
  Bottom 0.406: R27.2 39.81,52.56 arc45 40.1,53.26 R22.1
N$41
  Bottom 0.406: R33.2 54.45,51.72 arc-45 55.15,52.01 R11.1
N$42  (via drill 1 pad 1.68)
  Top 0.406: 51,28.57 R35.2 50.39,28.39 52,30 52,31 53,32 54,32 57,35 57,39 59,41 59,49 49,59 45,59 v42,62
  Bottom 0.406: S4.8 37.19,67.19 37,67 37,65 40,62 v42,62
N$43
  Top 0.406: RUV2.1 30.95,89 RUV1.2 CFT.1 35.95,88.95 40,93 52,93 56,89 56,88 55.65,87.65 U$2.P$2
N$44
  Bottom 0.406: BOOST.4 70.9,83.48 D1.A 72.65,86 L1.1
N$45
  Top 0.406: CSS.1 39,89 42,92 48,92 51,89 51,88 52,87 U$2.P$3
N$46
  Bottom 0.406: S2.4 S2.3 S2.2 S2.1 56.87,32 64,32 67.41,35.41 arc45 67.7,36.11 R16.1 arc45 67.95,38.88 LOHI.2
N$47
  Bottom 0.406: R47.2 R50.1
N$48  (via drill 1 pad 1.42)
  Top 0.406: RRAMP.1 44,87.95 CVCC.1 v42,90 | v58,90 58.75,89.25 U$2.P$9
  Bottom 0.406: v42,90 43,89 57,89 v58,90
N$49
  Bottom 0.406: BOOST.2 72,80 70.95,78.95 R48.2
N$50  (via drill 1 pad 1.68)
  Top 0.406: v60,38 61,38 62,39 v62,47
  Bottom 0.406: S2.8 S2.7 S2.6 S2.5 42,36.99 42,38 43,39 59,39 v60,38 | R8.1 72.43,44.71 arc45 71.73,45 67.83,45 arc-45 67.12,45.29 66.69,45.73 LOHI.6 66.69,49.31 66,50 65,50 v62,47
N$51
  Bottom 0.406: R48.1 68.55,76.6 C5.1
N$52
  Top 0.406: D2.A 69.9,77.1 66,81 64.05,81 RSENSE.1 64,83 61.3,85.7 U$2.P$13
N$53
  Top 0.406: RRAMP.2 CRAMP.1 52,86 52.35,86.35 U$2.P$4
N$54
  Top 0.406: RT1.2 57.95,77 RT.2
N$55
  Top 0.406: RUV1.1 RUV3.2
N$56
  Top 0.406: R49.1 CCOMP.1
N$57
  Top 0.406: U$2.P$8 52.5,83 52,83 49.95,80.95 CCOMP.2 CCOMP2.2 51.95,74 52,74 52.05,74.05 RFPP2.1 53,70 62.95,60.05 RFBT1.1 68,60 71,57 73,57 74,58 74,58.95 RCOMP1.2
N$58
  Top 0.406: R55.2 CCOMP2.1 47.05,75 47,75 46,74 42,74 40,76 40,80 43,83 50,83 51.4,84.4 U$2.P$7
N$59
  Top 0.406: U$2.P$10 59.65,87.65 61,89 CBOOT.1
N$60
  Top 0.406: CRST.2 63.95,75 62,75 61,76 61,83 59.6,84.4 U$2.P$15
N$61
  Top 0.406: Q1.2 Q1.1 65.83,83.17 64,85 64,87 | Q1.2 Q1.3 | Q1.2 67.37,82.64 69,81 71.9,81 D2.C 74.1,80.9 77,78 U$3.P$2 | CBOOT.2 64,88.95 64,87 | 64,87 63.35,86.35 U$2.P$12
N$62
  Top 0.406: RFPP2.2 53.05,76 RFBB1.1
N$63
  Top 0.406: 32,44 32.07,44.07 arc45 DIGI-2-AMP.1 | DIGI-2-AMP.2 DIGI-2-AMP.1 | R42.1 28.49,44.23 DIGI-2-AMP.1
N$64
  Top 0.406: DIGI-2.1 34.19,47.83 arc45 34.9,47.54 R43.1 39,45.58 39,44 37.95,42.95 DIGI-2-AMP.7 DIGI-2-AMP.6
N$65
  Top 0.406: U$2.P$11 57,87 57,89 55,91 55,92 56,93 69,93 73,89 73,85 71,83 70.08,83 Q1.4
N$66
  Top 0.406: R49.2 R55.1
N$67  (via drill 1 pad 1.68)
  Top 0.406: R37.1 37.29,29.06 arc-45 37,29.76 37,33 39.71,35.71 | 39.71,35.71 arc45 40,36.41 | 39.71,35.71 40,36 40,37 42,39 42,51 36,57 v35,57
  Bottom 0.406: S4.6 42.27,71.32 arc45 41.98,72.02 41,73 36.41,73 arc45 35.71,72.71 32,69 32,60 v35,57
N$68
  Top 0.406: 42.39,19.71 R44.2 42.04,19.9 arc45 42,20 42,23.18 arc-45 42.29,23.88 R36.1
N$69
  Top 0.406: R40.2 34.33,25.7 arc-45 34.04,26.4 R45.1
N$70  (via drill 1 pad 1.68)
  Top 0.406: R45.2 arc-45 34,30.38 34,33 38.71,37.71 arc45 39,38.41 41,40.41 41,50 36,55 34,55 v32,57
  Bottom 0.406: S4.5 44.81,70.78 arc45 44.52,71.48 42,74 34.41,74 arc45 33.71,73.71 30,70 30,59 v32,57
N$71
  Top 0.406: CCOMP3.2 CCOMP1.2 74,62.05 RCOMP2.2
N$72  (1 unrouted)
  Top 0.406: U$2.P$5 55.3,85.7 56,85 56,83 58,81 58,79.05
N$73
  Top 0.406: RCOMP2.1 RCOMP1.1
N$74
  Top 0.406: RFBT.1 RFBT1.2
N$75
  Bottom 0.406: R50.2 D1.C
OUT1
  Bottom 0.406: R29.1 31.72,16.27 arc45 32.42,15.98 R7.1 arc-45 35.35,16.14 R31.1 40.02,14.03 arc45 40.72,13.74 R24.1 41.71,13.29 arc45 42.41,13 44,13 45.17,14.18 arc45 R15.1 arc45 45.55,14.26 R23.2 49.28,13.13 arc45 49.57,12.43 50,12 63.59,12 arc45 64.29,12.29 73,21 73,22.62 arc-45 HILO.1
VCC  (via drill 1 pad 1.42, 1 pad 1.68)
  Top 0.406: R44.1 41.4,16.82 | R44.1 41.69,17.11 arc-45 40.99,16.82 R39.1 | R44.1 42.99,16.51 arc45 43.69,16.22 R4.1 48.83,13.43 arc45 49.53,13.14 R34.1 59.14,13.14 v61,15 | DIGI-1-AMP.8 56,43.64 v56,45 | DIGI-2-AMP.8 35.29,46 v27,46 | v27,39 28,38 28,37 27,36 26,36 24,38 18,38 17,39 17,56 19,58 23,58 25,60 25,66 26,67 46,67 47,66 48,66 v63,51 69,51 v70,50 81,50 v82,51
  Bottom 0.406: v61,15 61,17 69,25 70,25 71,26 72,26 73.22,27.23 HILO.8 76,30.87 76,45 73.88,47.12 LOHI.8 69.22,48.23 70,49 v70,50 | v56,45 62,51 v63,51 | v27,46 25,44 25,40 26,39 v27,39 | C2.1 74.45,78.4 C3.1 | R47.1 58.05,83.9 R46.1 59.05,83 | 59.05,83 59.45,83.4 C4.1 | 59.05,83 57,83 56,82 56,80 62,74 71,74 | 71,74 72,75 72,77 72.95,77.95 C2.1 | BOOST.1 74,79.62 C2.1 | 71,74 82,63 v82,51
VDD  (via drill 1 pad 1.42)
  Top 0.406: 42.05,86 CVCC.2 42,86 39.05,86 CSS.2 35,86.05 CFT.2 33,86.05 33,86 | 42.05,86 45,86 | 45,86 CRAMP.2 45.05,84.95 | 32.05,82.05 33,83 33,86 | 32.05,82.05 RUV3.1 23.95,82.05 21,85 21,86.05 CIO.2 | U$2.P$6 53.2,85 | 45.05,84.95 46,84 49,84 50,85 | 50,85 50.05,85.05 U$2.P$6 | 54,85 53.95,85.05 U$2.P$6 | RT.1 56.05,77.9 RFBB1.2 54.95,82.9 55,82.95 55,84 54,85 | 64,77 CRST.1 63.95,77 | 64,77 RSENSE.2 | 63.95,77 63,77 62,78 62,83 60,85 | 60,85 59.95,85.05 U$2.P$14 58.8,85 60,85 | 63.95,77 64,77 | 64,77 66,77 68,75 v68,72 | COUTX.2 77,64.95 77,58 79,56 COUT.- 81.54,55.46 85,52 85,48 68,31 v67,31 | 54,85 50,85 | 45.05,84.95 45,85 45,86 | 42.05,86 35,86 34,87 33,86 | 32.05,82.05 32,82 31,82 29,80 v29,78
  Bottom 0.406: 69.58,23 69.75,23.17 HILO.3 | v68,72 68,64 | 79,55 COUT.- | 68,64 76.54,55.46 COUT.- | HILO.4 69.58,23 | 69.58,23 70,23 71,24 71,25 73,25 78,30 78,32 79,33 COUT.- | LOHI.4 64.22,41 33,41 29,37 18,37 16,39 16,67 24,75 29,75 | 29,75 44,75 55,64 68,64 | v29,78 29,75 | HILO.5 67,30.51 v67,31
(copper drawn outside any net)
  shapes: Bottom circle x4, Top circle x4

### Text on the board
Top: Protopaja 13.7.2016 / UADIVOLECO / "Lime-Lemon"